# EasyEDA Pro project Propj-AlmuxCybernet.epro, schematic Schematic1
Board Name: RPB2026; Create Date: 2026-03-13; Page Name: P1; Project Name: Almux - Cybernet; Schematic Name: Schematic1; Update Date: 2026-03-17; Company: EasyEDA.com; Page Size: A4; Version: V1.0
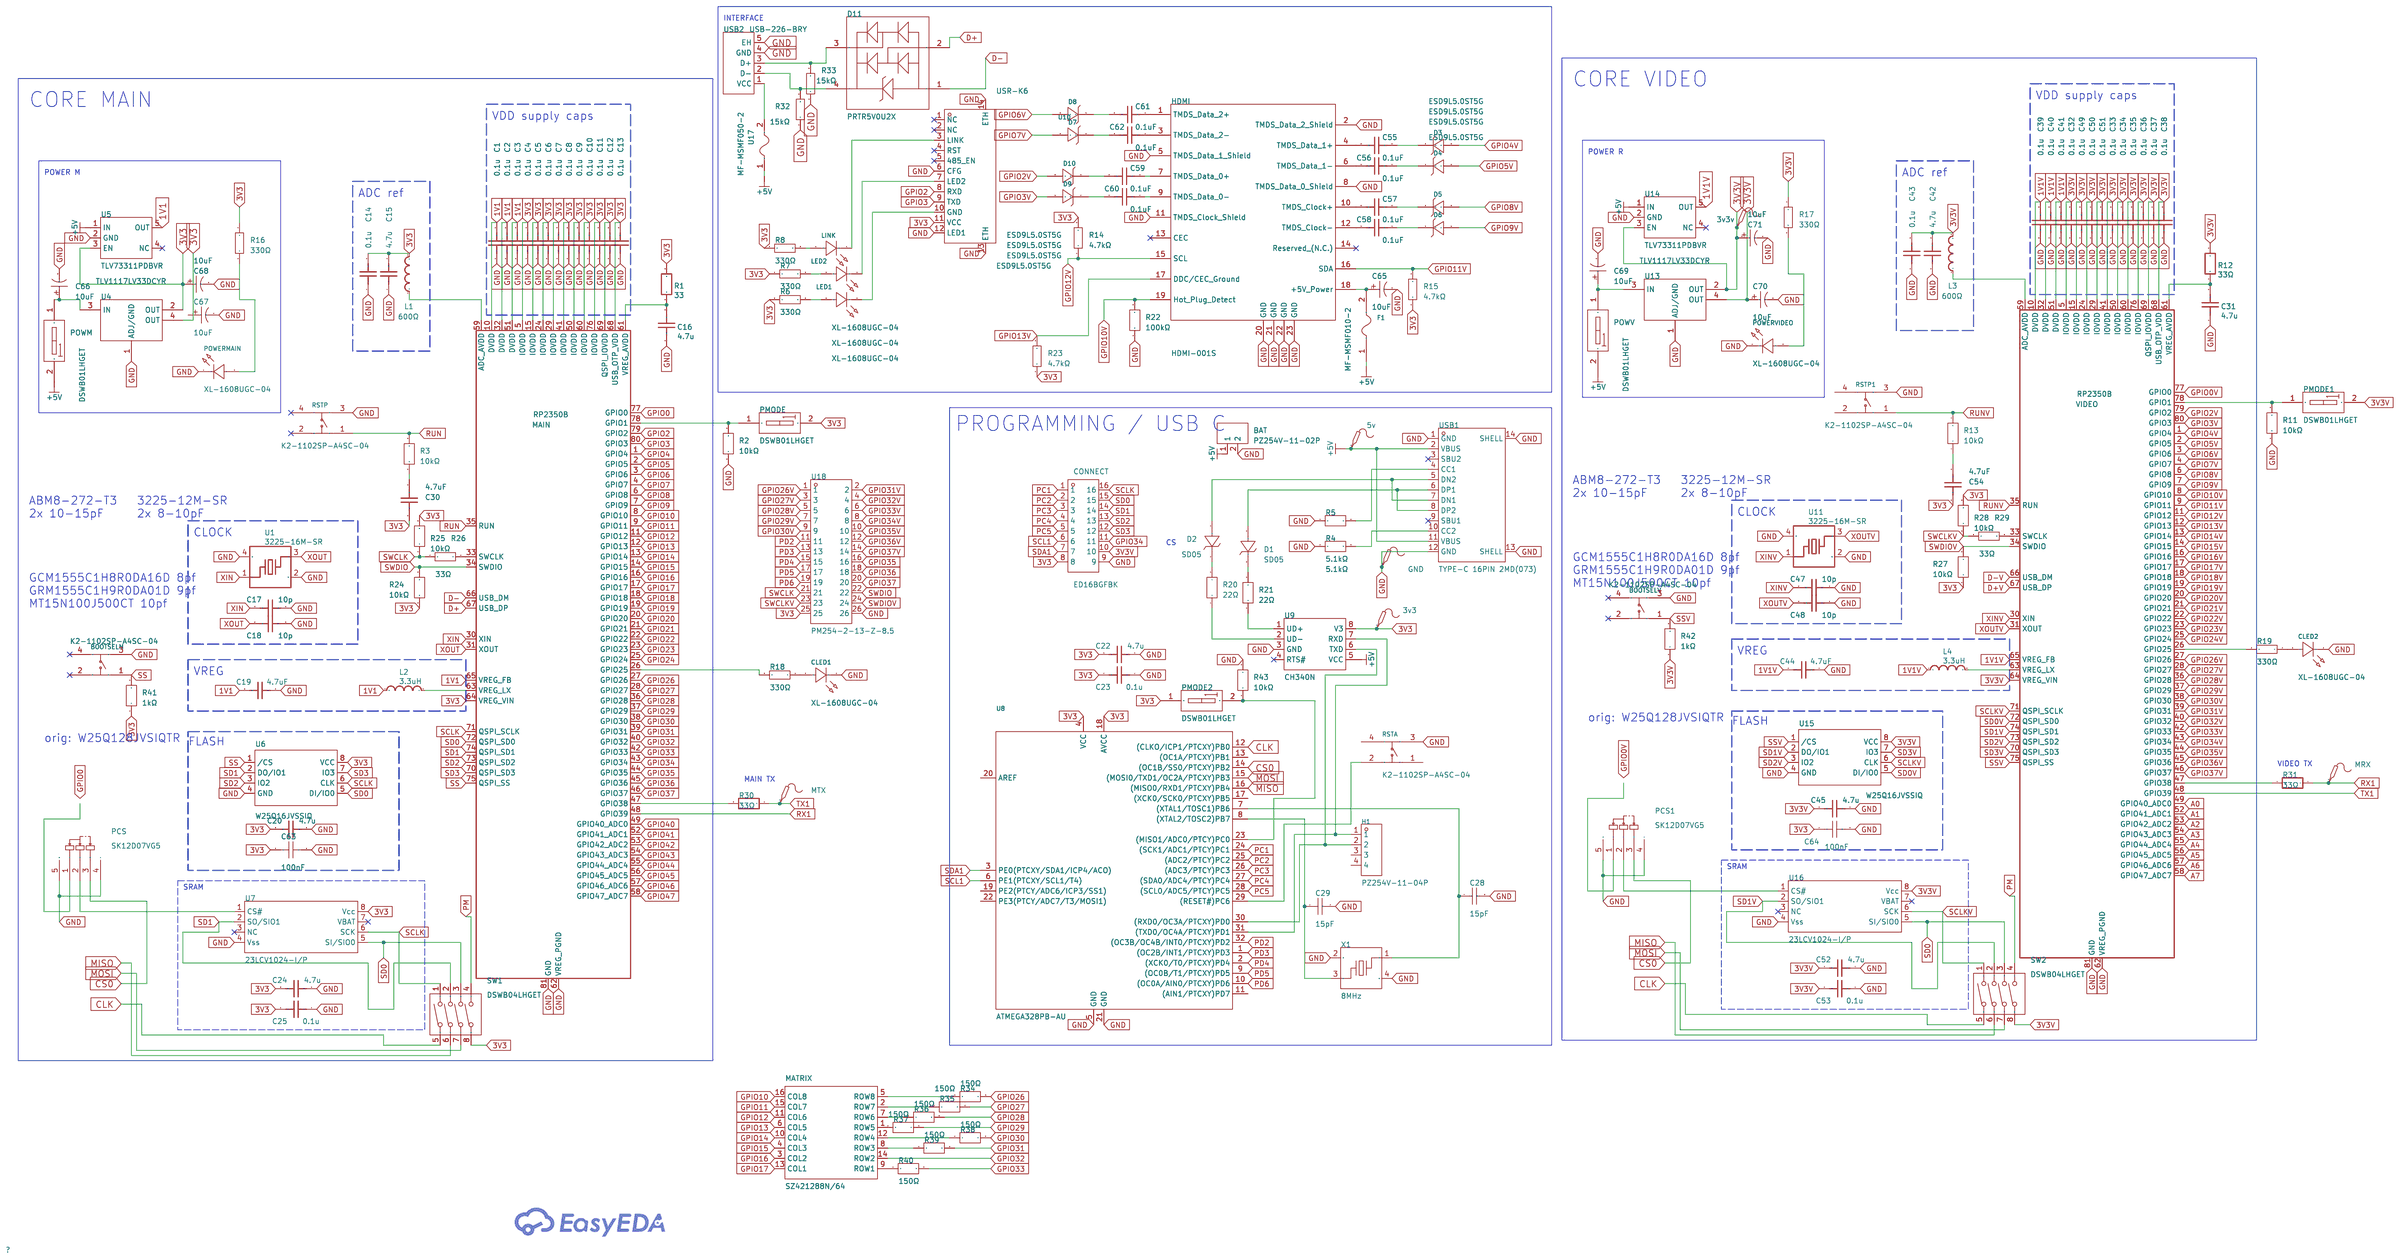
[diagram p1: schematic sheet]

## Parts
3v3  -  [Test-Point-0.5mm]
3v3v  -  [Test-Point-0.5mm]
5v  -  [Test-Point-0.5mm]
BAT  PZ254V-11-02P  [HDR-TH_2P-P2.54-V-M]
BOOTSELM  K2-1102SP-A4SC-04  [KEY-SMD_4P-L6.0-W6.0-P4.50-LS10.0]
BOOTSELV  K2-1102SP-A4SC-04  [KEY-SMD_4P-L6.0-W6.0-P4.50-LS10.0]
C1  0.1u  [C0402]
C2  0.1u  [C0402]
C3  0.1u  [C0402]
C4  0.1u  [C0402]
C5  0.1u  [C0402]
C6  0.1u  [C0402]
C7  0.1u  [C0402]
C8  0.1u  [C0402]
C9  0.1u  [C0402]
C10  0.1u  [C0402]
C11  0.1u  [C0402]
C12  0.1u  [C0402]
C13  0.1u  [C0402]
C14  0.1u  [C0402]
C15  4.7u  [C0603]
C16  4.7u  [C0603]
C17  10p  [C0402]
C18  10p  [C0402]
C19  4.7uF  [C0603]
C20  4.7u  [C0603]
C22  4.7u  [C0603]
C23  0.1u  [C0402]
C24  4.7u  [C0603]
C25  0.1u  [C0402]
C28  15pF  [C0603]
C29  15pF  [C0603]
C30  4.7uF  [C0603]
C31  4.7u  [C0603]
C32  0.1u  [C0402]
C33  0.1u  [C0402]
C34  0.1u  [C0402]
C35  0.1u  [C0402]
C36  0.1u  [C0402]
C37  0.1u  [C0402]
C38  0.1u  [C0402]
C39  0.1u  [C0402]
C40  0.1u  [C0402]
C41  0.1u  [C0402]
C42  4.7u  [C0603]
C43  0.1u  [C0402]
C44  4.7uF  [C0603]
C45  4.7u  [C0603]
C47  10p  [C0402]
C48  10p  [C0402]
C49  0.1u  [C0402]
C50  0.1u  [C0402]
C51  0.1u  [C0402]
C52  4.7u  [C0603]
C53  0.1u  [C0402]
C54  4.7uF  [C0603]
C55  0.1uF  [C0402]
C56  0.1uF  [C0402]
C57  0.1uF  [C0402]
C58  0.1uF  [C0402]
C59  0.1uF  [C0402]
C60  0.1uF  [C0402]
C61  0.1uF  [C0402]
C62  0.1uF  [C0402]
C63  100nF  [C0402]
C64  100nF  [C0402]
C65  10uF  [CAP-SMD_BD5.0-L5.3-W5.3-FD]
C66  10uF  [CAP-SMD_BD5.0-L5.3-W5.3-FD]
C67  10uF  [CAP-SMD_BD5.0-L5.3-W5.3-FD]
C68  10uF  [CAP-SMD_BD5.0-L5.3-W5.3-FD]
C69  10uF  [CAP-SMD_BD5.0-L5.3-W5.3-FD]
C70  10uF  [CAP-SMD_BD5.0-L5.3-W5.3-FD]
C71  10uF  [CAP-SMD_BD5.0-L5.3-W5.3-FD]
CLED1  XL-1608UGC-04  [LED0603-RD_GREEN]
CLED2  XL-1608UGC-04  [LED0603-RD_GREEN]
CONNECT  ED16BGFBK  [CONN-TH_ED16BGFBK]
D1  SD05  [SOD-323_L1.8-W1.3-LS2.5-FD]
D2  SD05  [SOD-323_L1.8-W1.3-LS2.5-FD]
D3  ESD9L5.0ST5G  [SOD-923_L0.8-W0.6-LS1.0-RD]
D4  ESD9L5.0ST5G  [SOD-923_L0.8-W0.6-LS1.0-RD]
D5  ESD9L5.0ST5G  [SOD-923_L0.8-W0.6-LS1.0-RD]
D6  ESD9L5.0ST5G  [SOD-923_L0.8-W0.6-LS1.0-RD]
D7  ESD9L5.0ST5G  [SOD-923_L0.8-W0.6-LS1.0-RD]
D8  ESD9L5.0ST5G  [SOD-923_L0.8-W0.6-LS1.0-RD]
D9  ESD9L5.0ST5G  [SOD-923_L0.8-W0.6-LS1.0-RD]
D10  ESD9L5.0ST5G  [SOD-923_L0.8-W0.6-LS1.0-RD]
D11  PRTR5V0U2X  [SOT-143_L2.9-W1.3-P1.92-LS2.3-BL]
F1  MF-MSMF010-2  [F1812]
GND  -  [Test-Point-0.5mm]
H1  PZ254V-11-04P  [HDR-TH_4P-P2.54-V-M]
HDMI  HDMI-001S  [HDMI-SMD_HDMI-001S]
L1  600Ω  [L0603]
L2  3.3uH  [L1008]
L3  600Ω  [L0603]
L4  3.3uH  [L1008]
LED1  XL-1608UGC-04  [LED0603-RD_GREEN]
LED2  XL-1608UGC-04  [LED0603-RD_GREEN]
LINK  XL-1608UGC-04  [LED0603-RD_GREEN]
MAIN  RP2350B  [QFN-80_L10.0-W10.0-P0.40-TL-EP3.4]
MATRIX  SZ421288N/64  [LED-SEG-TH_SZ421288N-64]
MRX  -  [Test-Point-0.5mm]
MTX  -  [Test-Point-0.5mm]
PCS  SK12D07VG5  [SW-TH_SK12D07VG5-1]
PCS1  SK12D07VG5  [SW-TH_SK12D07VG5-1]
PMODE  DSWB01LHGET  [SW-TH_DSWB01LHGET]
PMODE1  DSWB01LHGET  [SW-TH_DSWB01LHGET]
PMODE2  DSWB01LHGET  [SW-TH_DSWB01LHGET]
POWERMAIN  XL-1608UGC-04  [LED0603-RD_GREEN]
POWERVIDEO  XL-1608UGC-04  [LED0603-RD_GREEN]
POWM  DSWB01LHGET  [SW-TH_DSWB01LHGET]
POWV  DSWB01LHGET  [SW-TH_DSWB01LHGET]
R1  33  [R0402]
R2  10kΩ  [R0805]
R3  10kΩ  [R0805]
R4  5.1kΩ  [R1206]
R5  5.1kΩ  [R1206]
R6  330Ω  [R0603]
R7  330Ω  [R0603]
R8  330Ω  [R0603]
R11  10kΩ  [R0805]
R12  33Ω  [R0402]
R13  10kΩ  [R0805]
R14  4.7kΩ  [R0603]
R15  4.7kΩ  [R0603]
R16  330Ω  [R0603]
R17  330Ω  [R0603]
R18  330Ω  [R0603]
R19  330Ω  [R0603]
R20  22Ω  [R0603]
R21  22Ω  [R0603]
R22  100kΩ  [R1206]
R23  4.7kΩ  [R0603]
R24  10kΩ  [R0805]
R25  10kΩ  [R0805]
R26  33Ω  [R0603]
R27  10kΩ  [R0805]
R28  10kΩ  [R0805]
R29  33Ω  [R0603]
R30  33Ω  [R0402]
R31  33Ω  [R0402]
R32  15kΩ  [R0805]
R33  15kΩ  [R0805]
R34  150Ω  [R0805]
R35  150Ω  [R0805]
R36  150Ω  [R0805]
R37  150Ω  [R0805]
R38  150Ω  [R0805]
R39  150Ω  [R0805]
R40  150Ω  [R0805]
R41  1kΩ  [R0603]
R42  1kΩ  [R0603]
R43  10kΩ  [R0805]
RSTA  K2-1102SP-A4SC-04  [KEY-SMD_4P-L6.0-W6.0-P4.50-LS10.0]
RSTP  K2-1102SP-A4SC-04  [KEY-SMD_4P-L6.0-W6.0-P4.50-LS10.0]
RSTP1  K2-1102SP-A4SC-04  [KEY-SMD_4P-L6.0-W6.0-P4.50-LS10.0]
SW1  DSWB04LHGET  [SW-TH_DSWB04LHGET]
SW2  DSWB04LHGET  [SW-TH_DSWB04LHGET]
U1  3225-16M-SR  [CRYSTAL-SMD_4P-L3.2-W2.5-BL]
U4  TLV1117LV33DCYR  [SOT-223_L6.7-W3.5-P2.30-BR]
U5  TLV73311PDBVR  [SOT-23-5_L2.9-W1.6-P0.95-LS2.8-BR]
U6  W25Q16JVSSIQ  [SOIC-8_L5.3-W5.3-P1.27-LS8.0-BL]
U7  23LCV1024-I/P  [PDIP-8_L9.3-W6.4-P2.54-LS7.6-BL]
U8  ATMEGA328PB-AU  [TQFP-32_L7.0-W7.0-P0.80-LS9.0-BL]
U9  CH340N  [SOP-8_L4.9-W3.9-P1.27-LS6.0-BL]
U10  USR-K6  [COMM_USR-K6]
U11  3225-16M-SR  [CRYSTAL-SMD_4P-L3.2-W2.5-BL]
U13  TLV1117LV33DCYR  [SOT-223_L6.7-W3.5-P2.30-BR]
U14  TLV73311PDBVR  [SOT-23-5_L2.9-W1.6-P0.95-LS2.8-BR]
U15  W25Q16JVSSIQ  [SOIC-8_L5.3-W5.3-P1.27-LS8.0-BL]
U16  23LCV1024-I/P  [PDIP-8_L9.3-W6.4-P2.54-LS7.6-BL]
U17  MF-MSMF050-2  [F1812]
U18  PM254-2-13-Z-8.5  [HDR-TH_26P-P2.54-V-F-R2-C13-S2.54-1]
USB1  TYPE-C 16PIN 2MD(073)  [USB-C-SMD_TYPE-C-6PIN-2MD-073]
USB2  USB-226-BRY  [USB-A-TH_USB-226-BRY]
VIDEO  RP2350B  [QFN-80_L10.0-W10.0-P0.40-TL-EP3.4]
X1  8MHz  [CRYSTAL-SMD_4P-L3.2-W2.5-BL]

## Library data of the parts
3v3 3v3v 5v GND MRX MTX = Test-Point: Test Point 测试点
BAT = PZ254V-11-02P: Pin Structure:1x2P Pitch:2.54mm Row Spacing:- Circluar Pins/Square Pins:Pin Header Mounting Type:Through Hole Number of Rows:1 Number of Pins:2P Current Rating:3A Voltage Rating (Max):250V Length of Mating Pin:6mm Insulation Height:2.5mm Length of End Con; LCSC Part Name: 1x2P 间距:2.54mm 方针 直插; Supplier Part: C492401; Manufacturer: XFCN(兴飞); Supplier Footprint: 插件,P=2.54mm; JLCPCB Part Class: Extended Part; Datasheet: https://item.szlcsc.com/datasheet/PZ254V-11-02P/502957.html; Supplier: LCSC; Pin Structure: 1x2P; Pitch: 2.54mm; Circluar Pins/Square Pins: Pin Header; Mounting Type: Through Hole; Number of Rows: 1; Number of Pins: 2P; Current Rating: 3A; Voltage Rating (Max): 250V; Length of Mating Pin: 6mm; Insulation Height: 2.5mm; Length of End Connection Pin: 3mm; Contact Material: Brass; Operating Temperature: -40℃~+105℃; Color: Black
BOOTSELM BOOTSELV RSTA RSTP RSTP1 = K2-1102SP-A4SC-04: Circuit:SPST Actuator Style:Round Button Operating Force:2.5N Mounting Type:Surface Mount,Vertical Length:6mm Width:6mm Switch Height:4.3mm Contact Current:50mA Voltage Rating:12V With Lamp:- Life:100,000 Cycles Operating Temperature:-25℃~+85℃ Operating T; LCSC Part Name: 高品质 轻触开关 6*6*4.3 圆柄; Supplier Part: C83916; Manufacturer: 韩国韩荣; Supplier Footprint: SMD-4P,6x6mm; JLCPCB Part Class: Extended Part; Datasheet: https://item.szlcsc.com/datasheet/K2-1102SP-A4SC-04/85083.html; Supplier: LCSC; Circuit: SPST; Actuator Style: Round Button; Operating Force: 2.5N; Mounting Type: Surface Mount,Vertical; Length: 6mm; Width: 6mm; Switch Height: 4.3mm; Contact Current: 50mA; Voltage Rating: 12V; Life: 100,000 Cycles; Operating Temperature: -25℃~+85℃
C1-C14 C23 C25 C32-C41 C43 C49-C51 C53 C55-C62 = 0.1u: Supplier Part: CL05B104KP5NNNC; Supplier: Tme; Manufacturer Part: CL05B104KP5NNNC; Manufacturer: SAMSUNG; nameAlias: Value(F); Contributor: LCEDA_Lib; spicePre: C; spiceSymbolName: C_0402_US
C15 C16 C19 C20 C22 C24 C30 C31 C42 C44 C45 C52 C54 = 4.7u: Supplier Part: 0603X475K100CT; Supplier: Tme; Manufacturer Part: 0603X475K100CT; Manufacturer: WALSIN; nameAlias: Value(F); Contributor: LCEDA_Lib; spicePre: C; spiceSymbolName: C_0402_US
C17 C18 C47 C48 = 10p: Supplier Part: MT15N100J500CT; Supplier: Tme; Manufacturer Part: MT15N100J500CT; Manufacturer: WALSIN; nameAlias: Value(F); Contributor: LCEDA_Lib; spicePre: C; spiceSymbolName: C_0402_US
C28 C29 = CL10C150JB8NNNC: Capacitance:15pF Tolerance:±5% Tolerance:±5% Voltage Rating:50V Temperature Coefficient:C0G; LCSC Part Name: 15pF ±5% 50V; Supplier Part: C1644; Manufacturer: SAMSUNG(三星); Supplier Footprint: 0603; JLCPCB Part Class: Basic Part; Datasheet: https://item.szlcsc.com/datasheet/CL10C150JB8NNNC/1996.html; Supplier: LCSC; Tolerance: ±5%; Voltage Rating: 50V; Temperature Coefficient: C0G
C63 C64 = CL05B104KB54PNC: Capacitance:100nF Tolerance:±10% Tolerance:±10% Voltage Rating:50V Temperature Coefficient:X7R; LCSC Part Name: 100nF ±10% 50V; Supplier Part: C307331; Manufacturer: SAMSUNG(三星); Supplier Footprint: 0402; JLCPCB Part Class: Basic Part; Datasheet: https://item.szlcsc.com/datasheet/CL05B104KB54PNC/291005.html; Supplier: LCSC; Tolerance: ±10%; Voltage Rating: 50V; Temperature Coefficient: X7R
C65-C71 = RVT1H100M0505_C72487: Capacitance:10uF Tolerance:±20% Tolerance:±20% Voltage Rating:50V Ripple Current:17mA@120Hz Equivalent Series Resistance(ESR):- Diameter:5mm Height - Seated (Max):5.4mm Lifetime:2000hrs@105℃ Operating Temperature:-40℃~+105℃ Operating Temperature:-40℃~+105; LCSC Part Name: 10uF ±20% 50V; Supplier Part: C72487; Manufacturer: ROQANG(容强); Manufacturer Part: RVT1H100M0505; Supplier Footprint: SMD,D5xL5.4mm; JLCPCB Part Class: Extended Part; Datasheet: https://item.szlcsc.com/datasheet/RVT1H100M0505/73598.html; Supplier: LCSC; Tolerance: ±20%; Voltage Rating: 50V; Ripple Current: 17mA@120Hz; Diameter: 5mm; Height - Seated (Max): 5.4mm; Lifetime: 2000hrs@105℃; Operating Temperature: -40℃~+105℃
CLED1 CLED2 LED1 LED2 LINK POWERMAIN POWERVIDEO = XL-1608UGC-04: Lamp Holder Type:- Illumination Color:Emerald Green Voltage - Forward(Vf):3.3V Voltage - Forward(Vf):3.3V Power(Watts):70mW Forward Current:20mA Wavelength - Dominant:515nm~535nm Wavelength - Dominant:515nm~535nm Peak Wavelength:525nm Diode Configuration:; LCSC Part Name: 0603翠绿贴片式发光二极管; Supplier Part: C965804; Manufacturer: XINGLIGHT(成兴光); Supplier Footprint: 0603; JLCPCB Part Class: Extended Part; Datasheet: https://item.szlcsc.com/datasheet/XL-1608UGC-04/1051413.html; Supplier: LCSC; Illumination Color: Emerald Green; Voltage - Forward(Vf): 3.3V; Power(Watts): 70mW; Forward Current: 20mA; Wavelength - Dominant: 515nm~535nm; Peak Wavelength: 525nm; Diode Configuration: Discrete Diode; Lens Color: Water Clear; Luminous Intensity: 810mcd; Viewing Angle: 120°; Mounting Style: Top-mount; Operating Temperature: -40℃~+85℃
CONNECT = ED16BGFBK: Connector Type:EDGE SLOT Pitch:2.54mm Number of Pins:16P Mounting Type:Through Hole Height Above Board:15.6mm Contact Material:Copper Alloy Contact Plating:Gold Operating Temperature:-55℃~+125℃ Operating Temperature:-55℃~+125℃; LCSC Part Name: 2.54mm P数:16P; Supplier Part: C5173292; Manufacturer: WingTAT(格林柏); Supplier Footprint: 插件,P=2.54mm; JLCPCB Part Class: Extended Part; Datasheet: https://item.szlcsc.com/datasheet/ED16BGFBK/5822875.html; Supplier: LCSC; Connector Type: EDGE SLOT; Pitch: 2.54mm; Number of Pins: 16P; Mounting Type: Through Hole; Height Above Board: 15.6mm; Contact Material: Copper Alloy; Contact Plating: Gold; Operating Temperature: -55℃~+125℃
D1 D2 = SD05_C502527: Polarity:Unidirectional Reverse Stand-Off Voltage (Vrwm):5V Clamping Voltage:18V Peak Pulse Current (Ipp):17A Peak Pulse Power Dissipation (Ppp):350W Voltage - Breakdown:6V Reverse Leakage Current (Ir):1uA Number of Channels:1 Operating Temperature:-55℃~+; LCSC Part Name: 单向TVS 5V截止 峰值脉冲电流：17A; Supplier Part: C502527; Manufacturer: MDD(辰达半导体); Supplier Footprint: SOD-323; JLCPCB Part Class: Extended Part; Datasheet: https://item.szlcsc.com/datasheet/SD05/515033.html; Supplier: LCSC; Polarity: Unidirectional; Reverse Stand-Off Voltage (Vrwm): 5V; Clamping Voltage: 18V; Peak Pulse Current (Ipp): 17A; Peak Pulse Power Dissipation (Ppp): 350W; Voltage - Breakdown: 6V; Reverse Leakage Current (Ir): 1uA; Number of Channels: 1; Operating Temperature: -55℃~+125℃; level of protection: IEC 61000-4-2；IEC 61000-4-4; Type: TVS; Junction Capacitance: 10pF
D3-D10 = ESD9L5.0ST5G: Polarity:Unidirectional Reverse Stand-Off Voltage (Vrwm):5V Clamping Voltage:9.8V Peak Pulse Current (Ipp):1A Peak Pulse Power Dissipation (Ppp):- Voltage - Breakdown:5.4V Reverse Leakage Current (Ir):1uA Number of Channels:1 Operating Temperature:-55℃~+1; LCSC Part Name: 单向ESD 5V截止 峰值脉冲电流：1A; Supplier Part: C82326; Manufacturer: onsemi(安森美); Supplier Footprint: SOD-923; JLCPCB Part Class: Extended Part; Datasheet: https://item.szlcsc.com/datasheet/ESD9L5.0ST5G/83483.html; Supplier: LCSC; Polarity: Unidirectional; Reverse Stand-Off Voltage (Vrwm): 5V; Clamping Voltage: 9.8V; Peak Pulse Current (Ipp): 1A; Voltage - Breakdown: 5.4V; Reverse Leakage Current (Ir): 1uA; Number of Channels: 1; Operating Temperature: -55℃~+150℃@(Tj); level of protection: IEC 61000-4-2; Type: ESD; Junction Capacitance: 0.9pF
D11 = PRTR5V0U2X_C21713980: Polarity:Unidirectional Reverse Stand-Off Voltage (Vrwm):5V Clamping Voltage:14V；16V Peak Pulse Current (Ipp):4A Peak Pulse Power Dissipation (Ppp):60W Voltage - Breakdown:6V Reverse Leakage Current (Ir):500nA Number of Channels:2 Operating Temperature:-5; LCSC Part Name: 丝印WR1 单向ESD 5V截止 峰值脉冲电流：4A; Supplier Part: C21713980; Manufacturer: GOODWORK(固得沃克); Supplier Footprint: SOT-143; JLCPCB Part Class: Extended Part; Datasheet: https://item.szlcsc.com/datasheet/PRTR5V0U2X/23140173.html; Supplier: LCSC; Polarity: Unidirectional; Reverse Stand-Off Voltage (Vrwm): 5V; Clamping Voltage: 14V；16V; Peak Pulse Current (Ipp): 4A; Peak Pulse Power Dissipation (Ppp): 60W; Voltage - Breakdown: 6V; Reverse Leakage Current (Ir): 500nA; Number of Channels: 2; Operating Temperature: -55℃~+125℃; level of protection: IEC 61000-4-2; Type: ESD; Junction Capacitance: 0.6pF；0.3pF
F1 = MF-MSMF010-2: Voltage - Max:60V Current - Max:40A Hold Current:100mA Trip Current:300mA Resistance - Initial (Ri) (Min):700mΩ Resistance - Post Trip (R1) (Max):15Ω Time to Trip(Max):- Operating Temperature:-40℃~+85℃ Operating Temperature:-40℃~+85℃ Length:5.4mm Width:3.; LCSC Part Name: 60V 100mA 1812自恢复; Supplier Part: C12430; Manufacturer: BOURNS; Supplier Footprint: 1812; JLCPCB Part Class: Extended Part; Datasheet: https://item.szlcsc.com/datasheet/MF-MSMF010-2/13063.html; Supplier: LCSC; Voltage - Max: 60V; Current - Max: 40A; Hold Current: 100mA; Trip Current: 300mA; Resistance - Initial (Ri) (Min): 700mΩ; Resistance - Post Trip (R1) (Max): 15Ω; Operating Temperature: -40℃~+85℃; Length: 5.4mm; Width: 3.2mm
H1 = PZ254V-11-04P: Pin Structure:1x4P Pitch:2.54mm Row Spacing:- Circluar Pins/Square Pins:Pin Header Mounting Type:Through Hole Number of Rows:1 Number of Pins:4P Current Rating:3A Voltage Rating (Max):250V Length of Mating Pin:6mm Insulation Height:2.5mm Length of End Con; LCSC Part Name: 1x4P 间距:2.54mm 方针 直插; Supplier Part: C2691448; Manufacturer: XFCN(兴飞); Supplier Footprint: 插件,P=2.54mm; JLCPCB Part Class: Extended Part; Datasheet: https://item.szlcsc.com/datasheet/PZ254V-11-04P/2801085.html; Supplier: LCSC; Pin Structure: 1x4P; Pitch: 2.54mm; Circluar Pins/Square Pins: Pin Header; Mounting Type: Through Hole; Number of Rows: 1; Number of Pins: 4P; Current Rating: 3A; Voltage Rating (Max): 250V; Length of Mating Pin: 6mm; Insulation Height: 2.5mm; Length of End Connection Pin: 3mm; Operating Temperature: -40℃~+105℃; Color: Black
HDMI = HDMI-001S: Connector Type:HDMI-A Gender:Female Number of Pins:19P Mounting Type:Surface Mount, Right Angle Current Rating:- Voltage Rating:- Operating Temperature:- Operating Temperature:-; Supplier Part: C720616; Manufacturer: XUNPU(讯普); Supplier Footprint: SMD; JLCPCB Part Class: Extended Part; Datasheet: https://item.szlcsc.com/datasheet/HDMI-001S/763623.html; Supplier: LCSC; Connector Type: HDMI-A; Gender: Female; Number of Pins: 19P; Mounting Type: Surface Mount, Right Angle
L1 L3 = 600Ω: Supplier: Tme; Manufacturer: muRata; Manufacturer Part: BLM18HE601SN1D; Supplier Part: BLM18HE601SN1D; nameAlias: Value; spicePre: L; spiceSymbolName: BLM18HE601SN1D
L2 L4 = 3.3uH: Supplier: Tme; Supplier Part: LQM2HPN3R3MG0L; Manufacturer: MURATA; Manufacturer Part: LQM2HPN3R3MG0L; nameAlias: Value; Contributor: Nephrite; spicePre: L; spiceSymbolName: AOTA-B201610S3R3-101-T
MAIN VIDEO = RP2350B: Supplier: LCSC; Supplier Part: C9900136713; Manufacturer: null; Contributor: lcsc; spicePre: U
MATRIX = SZ421288N/64: Dot Matrix Number:8x8 Emitting Color:Red Polarity:共阴极; LCSC Part Name: 8x8位共阴极红色LED点阵; Supplier Part: C2980922; Manufacturer: ARKLED(方舟); Supplier Footprint: 插件; JLCPCB Part Class: Extended Part; Datasheet: https://atta.szlcsc.com/upload/public/pdf/source/20220310/56594458C5EED5BEAFFDE966345907D8.pdf; Supplier: LCSC; Dot Matrix Number: 8x8; Emitting Color: Red; Polarity: 共阴极
PCS PCS1 = SK12D07VG5: Circuit:SPDT Actuator Style:- Termination Style:PC Pin Length:8.7mm Width:4.4mm Switch Height:4.7mm Mounting Type:- Actuator Color:- Current Rating:500mA Voltage Rating:50V Life:5,000 cycles Operating Temperature:-10℃~+50℃ Operating Temperature:-10℃~+50℃; Supplier Part: C431548; Manufacturer: SHOU HAN(首韩); Supplier Footprint: 插件,8.7x4.4mm; JLCPCB Part Class: Extended Part; Datasheet: https://item.szlcsc.com/datasheet/SK12D07VG5/427905.html; Supplier: LCSC; Circuit: SPDT; Termination Style: PC Pin; Length: 8.7mm; Width: 4.4mm; Switch Height: 4.7mm; Current Rating: 500mA; Voltage Rating: 50V; Life: 5,000 cycles; Operating Temperature: -10℃~+50℃
PMODE PMODE1 PMODE2 POWM POWV = DSWB01LHGET: Type:Slide, Rocked Circuit:SPST Number of Positions:1 Lead Pitch:- Operating Life:- Color:Red; LCSC Part Name: 红色宽体1位顶拨插件; Supplier Part: C126888; Manufacturer: YE; Supplier Footprint: 插件,9.9x4mm; JLCPCB Part Class: Extended Part; Datasheet: https://item.szlcsc.com/datasheet/DSWB01LHGET/138168.html; Supplier: LCSC; Type: Slide, Rocked; Circuit: SPST; Number of Positions: 1; Color: Red
R1 R12 R30 R31 = 33: Supplier Part: HP02-33R1%; Supplier: Tme; Manufacturer Part: HP02WAF330JTCE; Manufacturer: ROYALOHM; nameAlias: Value(Ω); Contributor: LCEDA_Lib; spicePre: R; spiceSymbolName: R_0402_EU
R2 R3 R11 R13 R24 R25 R27 R28 R43 = FRC0805J103TS: Type:Thick Film Resistor Resistance:10kΩ Tolerance:±5% Tolerance:±5% Power(Watts):125mW Voltage-Supply(Max):150V Temperature Coefficient:±100ppm/℃ Temperature Coefficient:±100ppm/℃ Operating Temperature:-55℃~+155℃ Operating Temperature:-55℃~+155℃; LCSC Part Name: 10kΩ ±5% 125mW 厚膜电阻; Supplier Part: C2930231; Manufacturer: FOJAN(富捷); Supplier Footprint: 0805; JLCPCB Part Class: Extended Part; Supplier: LCSC; Type: Thick Film Resistor; Tolerance: ±5%; Power(Watts): 125mW; Voltage-Supply(Max): 150V; Temperature Coefficient: ±100ppm/℃; Operating Temperature: -55℃~+155℃
R4 R5 = FRC1206J512 TS: Type:Thick Film Resistor Resistance:5.1kΩ Tolerance:±5% Tolerance:±5% Power(Watts):250mW Voltage-Supply(Max):200V Temperature Coefficient:±100ppm/℃ Temperature Coefficient:±100ppm/℃ Operating Temperature:-55℃~+155℃ Operating Temperature:-55℃~+155℃; LCSC Part Name: 5.1kΩ ±5% 250mW 厚膜电阻; Supplier Part: C2907509; Manufacturer: FOJAN(富捷); Supplier Footprint: 1206; JLCPCB Part Class: Extended Part; Supplier: LCSC; Type: Thick Film Resistor; Tolerance: ±5%; Power(Watts): 250mW; Voltage-Supply(Max): 200V; Temperature Coefficient: ±100ppm/℃; Operating Temperature: -55℃~+155℃
R6-R8 R16-R19 = 0603WAF3300T5E: Type:Thick Film Resistors Resistance: Tolerance:±1% Tolerance:±1% Power(Watts): Overload Voltage (Max): Temperature Coefficient:±100ppm/℃ Temperature Coefficient:±100ppm/℃ Operating Temperature Range:-55℃~+155℃ Operating Temperature Range:-55℃~+155℃; LCSC Part Name: 330Ω ±1% 100mW 厚膜电阻; Supplier Part: C23138; Manufacturer: UNI-ROYAL(厚声); Supplier Footprint: 0603; JLCPCB Part Class: Basic Part; Datasheet: https://atta.szlcsc.com/upload/public/pdf/source/20200306/C422600_1E6D84923E4A46A82E41ADD87F860B5C.pdf; Supplier: LCSC; Type: Thick Film Resistors; Tolerance: ±1%; Temperature Coefficient: ±100ppm/℃; Operating Temperature Range: -55℃~+155℃
R14 R15 R23 = 0603WAF4701T5E: Type:Thick Film Resistor Resistance:4.7kΩ Tolerance:±1% Tolerance:±1% Power(Watts):100mW Voltage-Supply(Max):75V Temperature Coefficient:±100ppm/℃ Temperature Coefficient:±100ppm/℃ Operating Temperature:-55℃~+155℃ Operating Temperature:-55℃~+155℃; LCSC Part Name: 4.7kΩ ±1% 100mW 厚膜电阻; Supplier Part: C23162; Manufacturer: UNI-ROYAL(厚声); Supplier Footprint: 0603; JLCPCB Part Class: Basic Part; Datasheet: https://item.szlcsc.com/datasheet/0603WAF4701T5E/23889.html; Supplier: LCSC; Type: Thick Film Resistor; Tolerance: ±1%; Power(Watts): 100mW; Voltage-Supply(Max): 75V; Temperature Coefficient: ±100ppm/℃; Operating Temperature: -55℃~+155℃
R20 R21 = FRC0603J220 TS: Type:Thick Film Resistor Resistance:22Ω Tolerance:±5% Tolerance:±5% Power(Watts):100mW Voltage-Supply(Max):75V Temperature Coefficient:±100ppm/℃ Temperature Coefficient:±100ppm/℃ Operating Temperature:-55℃~+155℃ Operating Temperature:-55℃~+155℃; LCSC Part Name: 22Ω ±5% 100mW 厚膜电阻; Supplier Part: C2907129; Manufacturer: FOJAN(富捷); Supplier Footprint: 0603; JLCPCB Part Class: Extended Part; Supplier: LCSC; Type: Thick Film Resistor; Tolerance: ±5%; Power(Watts): 100mW; Voltage-Supply(Max): 75V; Temperature Coefficient: ±100ppm/℃; Operating Temperature: -55℃~+155℃
R22 = FRC1206J104 TS: Type:Thick Film Resistor Resistance:100kΩ Tolerance:±5% Tolerance:±5% Power(Watts):250mW Voltage-Supply(Max):200V Temperature Coefficient:±100ppm/℃ Temperature Coefficient:±100ppm/℃ Operating Temperature:-55℃~+155℃ Operating Temperature:-55℃~+155℃; LCSC Part Name: 100kΩ ±5% 250mW 厚膜电阻; Supplier Part: C2907421; Manufacturer: FOJAN(富捷); Supplier Footprint: 1206; JLCPCB Part Class: Extended Part; Supplier: LCSC; Type: Thick Film Resistor; Tolerance: ±5%; Power(Watts): 250mW; Voltage-Supply(Max): 200V; Temperature Coefficient: ±100ppm/℃; Operating Temperature: -55℃~+155℃
R26 R29 = RC0603FR-0733RL: Type:Thick Film Resistor Resistance:33Ω Tolerance:±1% Tolerance:±1% Power(Watts):100mW Voltage-Supply(Max):75V Temperature Coefficient:±100ppm/℃ Temperature Coefficient:±100ppm/℃ Operating Temperature:-55℃~+155℃ Operating Temperature:-55℃~+155℃; LCSC Part Name: 厚膜电阻 33Ω ±1% 100mW; Supplier Part: C108661; Manufacturer: YAGEO(国巨); Supplier Footprint: 0603; JLCPCB Part Class: Extended Part; Datasheet: https://item.szlcsc.com/datasheet/RC0603FR-0733RL/109880.html; Supplier: LCSC; Type: Thick Film Resistor; Tolerance: ±1%; Power(Watts): 100mW; Voltage-Supply(Max): 75V; Temperature Coefficient: ±100ppm/℃; Operating Temperature: -55℃~+155℃
R32 R33 = RC0805FR-0715KL: Type:Thick Film Resistor Resistance:15kΩ Tolerance:±1% Tolerance:±1% Power(Watts):125mW Voltage-Supply(Max):150V Temperature Coefficient:±100ppm/℃ Temperature Coefficient:±100ppm/℃ Operating Temperature:-55℃~+155℃ Operating Temperature:-55℃~+155℃; LCSC Part Name: 厚膜电阻 15kΩ ±1% 125mW; Supplier Part: C114559; Manufacturer: YAGEO(国巨); Supplier Footprint: 0805; JLCPCB Part Class: Extended Part; Datasheet: https://item.szlcsc.com/datasheet/RC0805FR-0715KL/115803.html; Supplier: LCSC; Type: Thick Film Resistor; Tolerance: ±1%; Power(Watts): 125mW; Voltage-Supply(Max): 150V; Temperature Coefficient: ±100ppm/℃; Operating Temperature: -55℃~+155℃
R34-R40 = FRC0805J151 TS: Type:Thick Film Resistor Resistance:150Ω Tolerance:±5% Tolerance:±5% Power(Watts):125mW Voltage-Supply(Max):150V Temperature Coefficient:±100ppm/℃ Temperature Coefficient:±100ppm/℃ Operating Temperature:-55℃~+155℃ Operating Temperature:-55℃~+155℃; LCSC Part Name: 150Ω ±5% 125mW 厚膜电阻; Supplier Part: C2907300; Manufacturer: FOJAN(富捷); Supplier Footprint: 0805; JLCPCB Part Class: Extended Part; Supplier: LCSC; Type: Thick Film Resistor; Tolerance: ±5%; Power(Watts): 125mW; Voltage-Supply(Max): 150V; Temperature Coefficient: ±100ppm/℃; Operating Temperature: -55℃~+155℃
R41 R42 = FRC0603J102 TS: Type:Thick Film Resistor Resistance:1kΩ Tolerance:±5% Tolerance:±5% Power(Watts):100mW Voltage-Supply(Max):75V Temperature Coefficient:±100ppm/℃ Temperature Coefficient:±100ppm/℃ Operating Temperature:-55℃~+155℃ Operating Temperature:-55℃~+155℃; LCSC Part Name: 1kΩ ±5% 100mW 厚膜电阻; Supplier Part: C2907113; Manufacturer: FOJAN(富捷); Supplier Footprint: 0603; JLCPCB Part Class: Extended Part; Supplier: LCSC; Type: Thick Film Resistor; Tolerance: ±5%; Power(Watts): 100mW; Voltage-Supply(Max): 75V; Temperature Coefficient: ±100ppm/℃; Operating Temperature: -55℃~+155℃
SW1 SW2 = DSWB04LHGET: Type:Slide, Rocked Circuit:SPST Number of Positions:4 Lead Pitch:2.54mm Operating Life:- Color:Red; LCSC Part Name: 间距2.54mm 平拨,凸起式 4位拨码开关; Supplier Part: C99418; Manufacturer: YE; Supplier Footprint: 插件; JLCPCB Part Class: Extended Part; Datasheet: https://item.szlcsc.com/datasheet/DSWB04LHGET/100632.html; Supplier: LCSC; Type: Slide, Rocked; Circuit: SPST; Number of Positions: 4; Lead Pitch: 2.54mm; Color: Red
U1 U11 = 3225-16M-SR: Supplier: Tme; Supplier Part: 3225-12M-SR; Manufacturer: SR Passives; Contributor: lcsc; spicePre: U
U4 U13 = TLV1117LV33DCYR: Output Type:Fixed Maximum Input Voltage:5.5V Output Voltage:3.3V Output Voltage:3.3V Output Current:1A Power Supply Rejection Ratio (PSRR):75dB@(120Hz) Dropout Voltage:1.3V@(800mA) standby current:100uA Feature:ESD Protection；Low ESR；Thermal Protection(TS; LCSC Part Name: 1A 低压降稳压器; Supplier Part: C15578; Manufacturer: TI(德州仪器); Supplier Footprint: SOT-223; JLCPCB Part Class: Extended Part; Datasheet: https://www.ti.com/cn/lit/gpn/tlv1117lv; Supplier: LCSC; Output Type: Fixed; Maximum Input Voltage: 5.5V; Output Voltage: 3.3V; Output Current: 1A; Power Supply Rejection Ratio (PSRR): 75dB@(120Hz); Dropout Voltage: 1.3V@(800mA); standby current: 100uA; Feature: ESD Protection；Low ESR；Thermal Protection(TSD)；Overcurrent Protection(OCP)；Under-voltage Lockout; Operating Temperature: -40℃~+125℃; Output Polarity: Positive electrode; Number of Outputs: 1
U5 U14 = TLV73311PDBVR: Output Type:Fixed Voltage - Supply:5.5V Output Voltage:1.1V Output Voltage:1.1V Output Current:300mA Power Supply Rejection Ratio (PSRR):50dB@(1kHz) Voltage Dropout:125mV@(300mA) standby current:34uA Noise:120uVrms Features:Over Current Protection；Enable；; LCSC Part Name: 具有使能功能的 300mA、低 IQ、低压降无电容稳压器; Supplier Part: C2865431; Manufacturer: TI(德州仪器); Supplier Footprint: SOT-23-5; JLCPCB Part Class: Extended Part; Datasheet: https://www.ti.com/cn/lit/gpn/tlv733p; Supplier: LCSC; Output Type: Fixed; Voltage - Supply: 5.5V; Output Voltage: 1.1V; Output Current: 300mA; Power Supply Rejection Ratio (PSRR): 50dB@(1kHz); Voltage Dropout: 125mV@(300mA); standby current: 34uA; Noise: 120uVrms; Features: Over Current Protection；Enable；Over Temperature Protection; Operating Temperature: -40℃~+125℃@(Tj); Output Configuration: Positive; Number of Outputs: 1
U6 U15 = W25Q16JVSSIQ: Interface:SPI Memory Size:16Mbit Clock Frequency:133MHz Voltage - Supply:2.7V~3.6V Voltage - Supply:2.7V~3.6V Standby Supply Current:10uA Program / Erase Cycles:100,000 Cycles Page Programming Time (Tpp):3ms Data Retention - TDR (Year):20 Years Operating; LCSC Part Name: 支持双/四路SPI接口的3V、16Mbit 串行闪存; Supplier Part: C131025; Manufacturer: Winbond(华邦); Supplier Footprint: SOIC-8-208mil; JLCPCB Part Class: Extended Part; Datasheet: https://item.szlcsc.com/datasheet/W25Q16JVSSIQ/142317.html; Supplier: LCSC; Interface: SPI; Memory Size: 16Mbit; Clock Frequency: 133MHz; Voltage - Supply: 2.7V~3.6V; Standby Supply Current: 10uA; Program / Erase Cycles: 100,000 Cycles; Page Programming Time (Tpp): 3ms; Data Retention - TDR (Year): 20 Years; Operating Temperature: -40℃~+85℃
U7 U16 = 23LCV1024-I/P_C613595: Interface:SPI Memory Size:1Mbit Voltage - Supply:2.5V~5.5V Voltage - Supply:2.5V~5.5V Write Cycle Time(Tw):- Operating Temperature:-40℃~+85℃ Operating Temperature:-40℃~+85℃; Supplier Part: C613595; Manufacturer: MICROCHIP(美国微芯); Supplier Footprint: PDIP-8; JLCPCB Part Class: Extended Part; Datasheet: https://item.szlcsc.com/datasheet/23LCV1024-I/P/643603.html; Supplier: LCSC; Interface: SPI; Memory Size: 1Mbit; Voltage - Supply: 2.5V~5.5V; Operating Temperature: -40℃~+85℃
U8 = ATMEGA328PB-AU: CPU Core:AVR CPU Maximum Speed:20MHz Core Size:8 Bit Program Storage Size:32KB Program Memory Type:FLASH RAM Size:2KB EEPROM:1KB Number of I/O:27 ADC (Bit):10bit Oscillator Type:Built-in Voltage - Supply:1.8V~5.5V Voltage - Supply:1.8V~5.5V Operating Temp; Supplier Part: C132230; Manufacturer: MICROCHIP(美国微芯); Supplier Footprint: TQFP-32(7x7); JLCPCB Part Class: Extended Part; Datasheet: https://item.szlcsc.com/datasheet/ATMEGA328PB-AU/143529.html; Supplier: LCSC; CPU Core: AVR; CPU Maximum Speed: 20MHz; Core Size: 8 Bit; Program Storage Size: 32KB; Program Memory Type: FLASH; RAM Size: 2KB; EEPROM: 1KB; Number of I/O: 27; ADC (Bit): 10bit; Oscillator Type: Built-in; Voltage - Supply: 1.8V~5.5V; Operating Temperature: -40℃~+85℃
U9 = CH340N: Applications Function:USB to serial USB Protocol:USB 2.0 Number of Channels:1 Voltage - Supply:3.3V；5V Voltage - Supply:3.3V；5V Data Rate:2Mbps Operating Temperature:-20℃~+70℃ Operating Temperature:-20℃~+70℃; LCSC Part Name: USB2.0芯片CH340; Supplier Part: C2977777; Manufacturer: WCH(南京沁恒); Supplier Footprint: SOP-8; JLCPCB Part Class: Extended Part; Datasheet: https://item.szlcsc.com/datasheet/CH340N/3390257.html; Supplier: LCSC; Applications Function: USB to serial; USB Protocol: USB 2.0; Number of Channels: 1; Voltage - Supply: 3.3V；5V; Data Rate: 2Mbps; Operating Temperature: -20℃~+70℃
U10 = USR-K6: LCSC Part Name: 串口服务器 UART转以太网双向透传 低成本; Supplier Part: C488063; Manufacturer: USR(有人物联网); JLCPCB Part Class: Extended Part; Datasheet: https://atta.szlcsc.com/upload/public/pdf/source/20200225/C488063_5605EE6D817113C23433343EB461AA97.pdf; Supplier: LCSC
U17 = MF-MSMF050-2: Voltage - Max:15V Current - Max:100A Hold Current:500mA Trip Current:1A Resistance - Initial (Ri) (Min):150mΩ Resistance - Post Trip (R1) (Max):1Ω Time to Trip(Max):- Operating Temperature:-40℃~+85℃ Operating Temperature:-40℃~+85℃ Length:5.4mm Width:3.2mm; LCSC Part Name: 15V 500mA 1812自恢复; Supplier Part: C17313; Manufacturer: BOURNS; Supplier Footprint: 1812; JLCPCB Part Class: Extended Part; Datasheet: https://item.szlcsc.com/datasheet/MF-MSMF050-2/17998.html; Supplier: LCSC; Voltage - Max: 15V; Current - Max: 100A; Hold Current: 500mA; Trip Current: 1A; Resistance - Initial (Ri) (Min): 150mΩ; Resistance - Post Trip (R1) (Max): 1Ω; Operating Temperature: -40℃~+85℃; Length: 5.4mm; Width: 3.2mm
U18 = PM254-2-13-Z-8.5: Holes Structure:2x13P Pitch:2.54mm Row Spacing:2.54mm Circular Hole / Square Hole:Square Hole Mounting Type:Through Hole Number of Rows:2 Number of Positions:26P Current Rating:3A Voltage Rating (Max):- Holes Direction:Top Insulation Height:8.5mm Contact; LCSC Part Name: 2x13P 间距:2.54mm 直插; Supplier Part: C2897414; Manufacturer: HCTL(华灿天禄); Supplier Footprint: 插件,P=2.54mm; JLCPCB Part Class: Extended Part; Datasheet: https://item.szlcsc.com/datasheet/PM254-2-13-Z-8.5/3142419.html; Supplier: LCSC; Holes Structure: 2x13P; Pitch: 2.54mm; Row Spacing: 2.54mm; Circular Hole / Square Hole: Square Hole; Mounting Type: Through Hole; Number of Rows: 2; Number of Positions: 26P; Current Rating: 3A; Holes Direction: Top; Insulation Height: 8.5mm; Contact Material: Copper Alloy; Operating Temperature: -40℃~+105℃
USB1 = TYPE-C 16PIN 2MD(073): Connector Type:Type-C Protocol Standard:- Gender:Female Mounting Type:Surface Mount, Right Angle Number of Contacts:16P Number of Ports:1 Current Rating-Power:3A Voltage Rating:5V Connect-Disconnect Life:5,000 times Supplementary Features:- Center Height:; LCSC Part Name: 16P卧贴母座; Supplier Part: C2765186; Manufacturer: SHOU HAN(首韩); Supplier Footprint: SMD; JLCPCB Part Class: Extended Part; Datasheet: https://item.szlcsc.com/datasheet/TYPE-C%252016PIN%25202MD(073)/2901843.html; Supplier: LCSC; Connector Type: Type-C; Gender: Female; Mounting Type: Surface Mount, Right Angle; Number of Contacts: 16P; Number of Ports: 1; Current Rating-Power: 3A; Voltage Rating: 5V; Connect-Disconnect Life: 5,000 times; Detection color: Black; Operating Temperature: -25℃~+85℃
USB2 = USB-226-BRY: Connector Type:Type-A Protocol Standard:USB 2.0 Gender:Female Mounting Type:Vertical, Flag Number of Contacts:4P Number of Ports:1 Current Rating-Power:1.5A Voltage Rating:30V Length:19.4mm Detection color:White Operating Temperature:-20℃~+70℃ Operating T; LCSC Part Name: Type-A 母 侧插; Supplier Part: C720523; Manufacturer: XUNPU(讯普); Supplier Footprint: 插件; JLCPCB Part Class: Extended Part; Datasheet: https://item.szlcsc.com/datasheet/USB-226-BRY/763530.html; Supplier: LCSC; Connector Type: Type-A; Protocol Standard: USB 2.0; Gender: Female; Mounting Type: Vertical, Flag; Number of Contacts: 4P; Number of Ports: 1; Current Rating-Power: 1.5A; Voltage Rating: 30V; Length: 19.4mm; Detection color: White; Operating Temperature: -20℃~+70℃
X1 = X32258MOB4SI: Type:Crystal Oscillator Frequency:8MHz Normal temperature Frequency Tolerance:±10ppm Normal temperature Frequency Tolerance:±10ppm Load Capacitance:12pF Frequency Stability:±20ppm Frequency Stability:±20ppm Equivalent Series Resistance(ESR):150Ω Operating; LCSC Part Name: YSX321SL 8MHZ 4P 3225 12PF ±10PPM -40~85℃ (±20PPM); Supplier Part: C2682775; Manufacturer: YXC(扬兴晶振); Supplier Footprint: SMD3225-4P; JLCPCB Part Class: Extended Part; Datasheet: https://item.szlcsc.com/datasheet/X32258MOB4SI/2777872.html; Supplier: LCSC; Type: Crystal Oscillator; Normal temperature Frequency Tolerance: ±10ppm; Load Capacitance: 12pF; Frequency Stability: ±20ppm; Equivalent Series Resistance(ESR): 150Ω; Operating Temperature: -40℃~+85℃

## Nets
1V1: C1.2 C2.2 C3.2 C19.2 L2.1 MAIN.10(DVDD) MAIN.32(DVDD) MAIN.51(DVDD) MAIN.65(VREG_FB) U5.5(OUT)
1V1V: C39.2 C40.2 C41.2 C44.2 L4.1 U14.5(OUT) VIDEO.10(DVDD) VIDEO.32(DVDD) VIDEO.51(DVDD) VIDEO.65(VREG_FB)
3V3: 3v3.1 C4.2 C5.2 C6.2 C7.2 C8.2 C9.2 C10.2 C11.2 C12.2 C13.2 C14.2 C15.2 C20.2 C22.2 C23.2 C24.2 C25.2 C30.1 C30.2 C54.2 C63.1 C64.1 C68.1 CONNECT.8 L1.2 MAIN.5(IOVDD) MAIN.15(IOVDD) MAIN.24(IOVDD) MAIN.29(IOVDD) MAIN.41(IOVDD) MAIN.50(IOVDD) MAIN.60(IOVDD) MAIN.64(VREG_VIN) MAIN.68(USB_OTP_VDD) MAIN.69(QSPI_IOVDD) MAIN.76(IOVDD) PMODE.2 PMODE2.1(A1) R1.2 R3.1 R6.1 R7.1 R8.1 R14.2 R15.1 R16.1 R23.1 R24.1 R25.2 R27.1 R28.2 R41.1 SW1.8 U4.2(OUT) U4.4(OUT) U5.3(EN) U6.8(VCC) U7.8(Vcc) U8.4(VCC) U8.18(AVCC) U9.8(V3) U10.11(VCC) U18.25
3V3V: 3v3v.1 C32.2 C33.2 C34.2 C35.2 C36.2 C37.2 C38.2 C42.2 C43.2 C45.2 C49.2 C50.2 C51.2 C52.2 C53.2 C70.1 C71.1 CONNECT.10 L3.2 PMODE1.2 R12.2 R17.1 R42.1 SW2.8 U13.2(OUT) U13.4(OUT) U14.3(EN) U15.8(VCC) U16.8(Vcc) VIDEO.5(IOVDD) VIDEO.15(IOVDD) VIDEO.24(IOVDD) VIDEO.29(IOVDD) VIDEO.41(IOVDD) VIDEO.50(IOVDD) VIDEO.60(IOVDD) VIDEO.64(VREG_VIN) VIDEO.68(USB_OTP_VDD) VIDEO.69(QSPI_IOVDD) VIDEO.76(IOVDD)
+5V: 5v.1 BAT.1 F1.1 POWM.2 POWV.2 U5.1(IN) U9.5(VCC) U14.1(IN) U17.1 USB1.2(VBUS) USB1.11(VBUS)
GND: BAT.2 BOOTSELM.3 BOOTSELV.3 C1.1 C2.1 C3.1 C4.1 C5.1 C6.1 C7.1 C8.1 C9.1 C10.1 C11.1 C12.1 C13.1 C14.1 C15.1 C16.1 C17.1 C18.1 C19.1 C20.1 C22.1 C23.1 C24.1 C25.1 C28.2 C29.2 C31.1 C32.1 C33.1 C34.1 C35.1 C36.1 C37.1 C38.1 C39.1 C40.1 C41.1 C42.1 C43.1 C44.1 C45.1 C47.1 C48.1 C49.1 C50.1 C51.1 C52.1 C53.1 C63.2 C64.2 C65.2 C66.2 C67.2 C68.2 C69.2 C70.2 C71.2 CLED1.1(K) CLED2.1(K) CONNECT.9 GND.1 HDMI.2(TMDS Data 2 Shield) HDMI.5(TMDS Data 1 Shield) HDMI.8(TMDS Data 0 Shield) HDMI.11(TMDS Clock Shield) HDMI.20(GND) HDMI.21(GND) HDMI.22(GND) HDMI.23(GND) MAIN.62(VREG_PGND) MAIN.81(GND) PCS.4 PCS.5 PCS1.4 PCS1.5 POWERMAIN.1(K) POWERVIDEO.1(K) R2.1 R4.1 R5.1 R11.1 R22.1 R32.1 R33.1 R43.2 RSTA.3 RSTP.3 RSTP1.3 U1.2(GND) U1.4(GND) U4.1(ADJ/GND) U5.2(GND) U6.4(GND) U7.4(Vss) U8.5(GND) U8.21(GND) U9.3(GND) U10.6(CFG) U10.12(LED1) U10.13(ETH) U10.14(ETH) U11.2(GND) U11.4(GND) U13.1(ADJ/GND) U14.2(GND) U15.4(GND) U16.4(Vss) U18.26 USB1.1(GND) USB1.12(GND) USB1.13(SHELL) USB1.14(SHELL) USB2.4(GND) USB2.5(EH) VIDEO.62(VREG_PGND) VIDEO.81(GND) X1.2(GND) X1.4(GND)
A0: VIDEO.49(GPIO40_ADC0)
A1: VIDEO.52(GPIO41_ADC1)
A2: VIDEO.53(GPIO42_ADC2)
A3: VIDEO.54(GPIO43_ADC3)
A4: VIDEO.55(GPIO44_ADC4)
A5: VIDEO.56(GPIO45_ADC5)
A6: VIDEO.57(GPIO46_ADC6)
A7: VIDEO.58(GPIO47_ADC7)
CLK: SW1.5 SW2.5 U8.12((CLKO/ICP1/PTCXY)PB0)
CS0: PCS.3 PCS1.3 U8.14((OC1B/SS0/PTCXY)PB2)
D+: D11.2 MAIN.67(USB_DP)
D+V: VIDEO.67(USB_DP)
D-: D11.1 MAIN.66(USB_DM)
D-V: VIDEO.66(USB_DM)
GPIO0: MAIN.77(GPIO0)
GPIO0V: VIDEO.77(GPIO0)
GPIO2: MAIN.79(GPIO2) U10.8(RXD)
GPIO2V: D10.2(A) VIDEO.79(GPIO2)
GPIO3: MAIN.80(GPIO3) U10.9(TXD)
GPIO3V: D9.2(A) VIDEO.80(GPIO3)
GPIO4: MAIN.1(GPIO4)
GPIO4V: D3.2(A) VIDEO.1(GPIO4)
GPIO5: MAIN.2(GPIO5)
GPIO5V: D4.2(A) VIDEO.2(GPIO5)
GPIO6: MAIN.3(GPIO6)
GPIO6V: D8.2(A) VIDEO.3(GPIO6)
GPIO7: MAIN.4(GPIO7)
GPIO7V: D7.2(A) VIDEO.4(GPIO7)
GPIO8: MAIN.6(GPIO8)
GPIO8V: D5.2(A) VIDEO.6(GPIO8)
GPIO9: MAIN.7(GPIO9)
GPIO9V: D6.2(A) VIDEO.7(GPIO9)
GPIO10: MAIN.8(GPIO10) MATRIX.16(COL8)
GPIO10V: HDMI.19(Hot Plug Detect) R22.2 VIDEO.8(GPIO10)
GPIO11: MAIN.9(GPIO11) MATRIX.15(COL7)
GPIO11V: HDMI.16(SDA) R15.2 VIDEO.9(GPIO11)
GPIO12: MAIN.11(GPIO12) MATRIX.11(COL6)
GPIO12V: HDMI.15(SCL) R14.1 VIDEO.11(GPIO12)
GPIO13: MAIN.12(GPIO13) MATRIX.6(COL5)
GPIO13V: HDMI.17(DDC/CEC Ground) R23.2 VIDEO.12(GPIO13)
GPIO14: MAIN.13(GPIO14) MATRIX.10(COL4)
GPIO14V: VIDEO.13(GPIO14)
GPIO15: MAIN.14(GPIO15) MATRIX.4(COL3)
GPIO15V: VIDEO.14(GPIO15)
GPIO16: MAIN.16(GPIO16) MATRIX.3(COL2)
GPIO16V: VIDEO.16(GPIO16)
GPIO17: MAIN.17(GPIO17) MATRIX.13(COL1)
GPIO17V: VIDEO.17(GPIO17)
GPIO18: MAIN.18(GPIO18)
GPIO18V: VIDEO.18(GPIO18)
GPIO19: MAIN.19(GPIO19)
GPIO19V: VIDEO.19(GPIO19)
GPIO20: MAIN.20(GPIO20)
GPIO20V: VIDEO.20(GPIO20)
GPIO21: MAIN.21(GPIO21)
GPIO21V: VIDEO.21(GPIO21)
GPIO22: MAIN.22(GPIO22)
GPIO22V: VIDEO.22(GPIO22)
GPIO23: MAIN.23(GPIO23)
GPIO23V: VIDEO.23(GPIO23)
GPIO24: MAIN.25(GPIO24)
GPIO24V: VIDEO.25(GPIO24)
GPIO26: MAIN.27(GPIO26) R34.2
GPIO26V: U18.1 VIDEO.27(GPIO26)
GPIO27: MAIN.28(GPIO27) R35.2
GPIO27V: U18.3 VIDEO.28(GPIO27)
GPIO28: MAIN.36(GPIO28) R36.2
GPIO28V: U18.5 VIDEO.36(GPIO28)
GPIO29: MAIN.37(GPIO29) R37.2
GPIO29V: U18.7 VIDEO.37(GPIO29)
GPIO30: MAIN.38(GPIO30) R38.2
GPIO30V: U18.9 VIDEO.38(GPIO30)
GPIO31: MAIN.39(GPIO31) R39.2
GPIO31V: U18.2 VIDEO.39(GPIO31)
GPIO32: MAIN.40(GPIO32) MATRIX.14(ROW2)
GPIO32V: U18.4 VIDEO.40(GPIO32)
GPIO33: MAIN.42(GPIO33) R40.2
GPIO33V: U18.6 VIDEO.42(GPIO33)
GPIO34: CONNECT.11 MAIN.43(GPIO34)
GPIO34V: U18.8 VIDEO.43(GPIO34)
GPIO35: MAIN.44(GPIO35) U18.16
GPIO35V: U18.10 VIDEO.44(GPIO35)
GPIO36: MAIN.45(GPIO36) U18.18
GPIO36V: U18.12 VIDEO.45(GPIO36)
GPIO37: MAIN.46(GPIO37) U18.20
GPIO37V: U18.14 VIDEO.46(GPIO37)
GPIO40: MAIN.49(GPIO40_ADC0)
GPIO41: MAIN.52(GPIO41_ADC1)
GPIO42: MAIN.53(GPIO42_ADC2)
GPIO43: MAIN.54(GPIO43_ADC3)
GPIO44: MAIN.55(GPIO44_ADC4)
GPIO45: MAIN.56(GPIO45_ADC5)
GPIO46: MAIN.57(GPIO46_ADC6)
GPIO47: MAIN.58(GPIO47_ADC7)
MISO: SW1.6 SW2.6 U8.16((MISO0/RXD1/PTCXY)PB4)
MOSI: SW1.7 SW2.7 U8.15((MOSI0/TXD1/OC2A/PTCXY)PB3)
PC1: CONNECT.1 U8.24((SCK1/ADC1/PTCY)PC1)
PC2: CONNECT.2 U8.25((ADC2/PTCY)PC2)
PC3: CONNECT.3 U8.26((ADC3/PTCY)PC3)
PC4: CONNECT.4 U8.27((SDA0/ADC4/PTCY)PC4)
PC5: CONNECT.5 U8.28((SCL0/ADC5/PTCY)PC5)
PD2: U8.32((OC3B/OC4B/INT0/PTCXY)PD2) U18.11
PD3: U8.1((OC2B/INT1/PTCXY)PD3) U18.13
PD4: U8.2((XCK0/T0/PTCXY)PD4) U18.15
PD5: U8.9((OC0B/T1/PTCXY)PD5) U18.17
PD6: U8.10((OC0A/AIN0/PTCXY)PD6) U18.19
PM: SW1.4 SW2.4
RUN: MAIN.35(RUN) R3.2 RSTP.1
RUNV: R13.2 RSTP1.1 VIDEO.35(RUN)
RX1: MAIN.48(GPIO39) MRX.1 R31.1
SCL1: CONNECT.6 U8.6(PE1(PTCXY/SCL1/T4))
SCLK: CONNECT.16 MAIN.71(QSPI_SCLK) SW1.1 U6.6(CLK) U7.6(SCK)
SCLKV: SW2.1 U15.6(CLK) U16.6(SCK) VIDEO.71(QSPI_SCLK)
SD0: CONNECT.15 MAIN.72(QSPI_SD0) SW1.3 SW2.3 U6.5(DI/IO0) U7.5(SI/SIO0) U16.5(SI/SIO0)
SD0V: U15.5(DI/IO0) VIDEO.72(QSPI_SD0)
SD1: CONNECT.14 MAIN.74(QSPI_SD1) SW1.2 U6.2(DO/IO1) U7.2(SO/SIO1)
SD1V: SW2.2 U15.2(DO/IO1) U16.2(SO/SIO1) VIDEO.74(QSPI_SD1)
SD2: CONNECT.13 MAIN.73(QSPI_SD2) U6.3(IO2)
SD2V: U15.3(IO2) VIDEO.73(QSPI_SD2)
SD3: CONNECT.12 MAIN.70(QSPI_SD3) U6.7(IO3)
SD3V: U15.7(IO3) VIDEO.70(QSPI_SD3)
SDA1: CONNECT.7 U8.3(PE0(PTCXY/SDA1/ICP4/ACO))
SS: BOOTSELM.1 MAIN.75(QSPI_SS) R41.2 U6.1(/CS)
SSV: BOOTSELV.1 R42.2 U15.1(/CS) VIDEO.75(QSPI_SS)
SWCLK: R25.1 R26.1 U18.21
SWCLKV: R28.1 R29.1 U18.23
SWDIO: MAIN.34(SWDIO) R24.2 U18.22
SWDIOV: R27.2 U18.24 VIDEO.34(SWDIO)
TX1: MTX.1 R30.1 VIDEO.48(GPIO39)
XIN: C17.2 MAIN.30(XIN) U1.1
XINV: C47.2 U11.1 VIDEO.30(XIN)
XOUT: C18.2 MAIN.31(XOUT) U1.3
XOUTV: C48.2 U11.3 VIDEO.31(XOUT)
$1N4694: C16.2 MAIN.61(VREG_AVDD) R1.1
$1N4705: L1.1 MAIN.59(ADC_AVDD)
$1N4707: L2.2 MAIN.63(VREG_LX)
$1N7181: H1.1 U8.31((TXD0/OC4A/PTCXY)PD1) U9.7(RXD)
$1N7187: H1.2 U8.30((RXD0/OC3A/PTCXY)PD0) U9.6(TXD)
$1N7439: PCS.2 U7.1(CS#)
$1N7680: MAIN.78(GPIO1) PMODE.1(A1) R2.2
$1N8416: C28.1 U8.7((XTAL1/TOSC1)PB6) X1.1
$1N8458: C29.1 U8.8((XTAL2/TOSC2)PB7) X1.3
$1N8746: RSTA.2 U8.29((RESET#)PC6)
$1N13312: R4.2 USB1.10(CC2)
$1N13318: R5.2 USB1.4(CC1)
$1N13992: LINK.2(A) R8.2
$1N13996: LINK.1(K) U10.3(LINK)
$1N14043: LED2.2(A) R7.2
$1N14047: LED2.1(K) U10.7(LED2)
$1N14094: LED1.2(A) R6.2
$1N14099: LED1.1(K) U10.10(GND)
$1N17824: PMODE1.1(A1) R11.2 VIDEO.78(GPIO1)
$1N31329: PCS1.2 U16.1(CS#)
$1N31417: C31.2 R12.1 VIDEO.61(VREG_AVDD)
$1N31440: L3.1 VIDEO.59(ADC_AVDD)
$1N31469: L4.2 VIDEO.63(VREG_LX)
$1N31476: C54.1 R13.1
$1N32412: POWERMAIN.2(A) R16.2
$1N32573: POWERVIDEO.2(A) R17.2
$1N32800: CLED1.2(A) R18.1
$1N32808: MAIN.26(GPIO25) R18.2
$1N32913: CLED2.2(A) R19.1
$1N32921: R19.2 VIDEO.26(GPIO25)
$1N33051: C66.1 POWM.1(A1) U4.3(IN)
$1N33109: C69.1 POWV.1(A1) U13.3(IN)
$1N37624: D2.1(A) USB1.5(DN2) USB1.7(DN1)
$1N37671: D1.1(A) USB1.6(DP1) USB1.8(DP2)
$1N37752: D1.2(K) R21.2
$1N37756: R21.1 U9.1(UD+)
$1N37796: D2.2(K) R20.2
$1N37800: R20.1 U9.2(UD-)
$1N37832: C55.2 HDMI.4(TMDS Data 1+)
$1N37864: C56.2 HDMI.6(TMDS Data 1-)
$1N37928: C57.2 HDMI.10(TMDS Clock+)
$1N37930: C58.2 HDMI.12(TMDS Clock-)
$1N37996: C60.1 HDMI.9(TMDS Data 0-)
$1N38002: C59.1 HDMI.7(TMDS Data 0+)
$1N38064: C61.1 HDMI.1(TMDS Data 2+)
$1N38066: C62.1 HDMI.3(TMDS Data 2-)
$1N38363: C55.1 D3.1(C)
$1N38408: C56.1 D4.1(C)
$1N38543: C58.1 D6.1(C)
$1N38549: C57.1 D5.1(C)
$1N38651: C62.2 D7.1(C)
$1N38657: C61.2 D8.1(C)
$1N38747: C59.2 D10.1(C)
$1N38753: C60.2 D9.1(C)
$1N38892: MAIN.33(SWCLK) R26.2
$1N39060: R29.2 VIDEO.33(SWCLK)
$1N39477: R31.2 VIDEO.47(GPIO38)
$1N39520: MAIN.47(GPIO38) R30.2
$1N39637: D11.4 R32.2 USB2.2(D-)
$1N39643: D11.3 R33.2 USB2.3(D+)
$1N39903: U17.2 USB2.1(VCC)
$1N39994: C65.1 F1.2 HDMI.18(+5V Power)
$1N40638: MATRIX.5(ROW8) R34.1
$1N40684: MATRIX.2(ROW7) R35.1
$1N40727: MATRIX.7(ROW6) R36.1
$1N40770: MATRIX.1(ROW5) R37.1
$1N40813: MATRIX.12(ROW4) R38.1
$1N40893: MATRIX.9(ROW1) R40.1
$1N40936: MATRIX.8(ROW3) R39.1
$1N63110: PMODE2.2 R43.1 U8.23((MISO1/ADC0/PTCY)PC0)

Not connected (* = marked no-connect by the designer): BOOTSELM 2* 4*; BOOTSELV 2* 4*; C67 1; H1 3 4; HDMI 13(CEC)* 14(Reserved (N.C.))*; PCS 1; PCS1 1; RSTA 1 4; RSTP 2* 4*; RSTP1 2 4; U5 4(NC)*; U7 3(NC)* 7(VBAT)*; U8 11((AIN1/PTCXY)PD7) 13((OC1A/PTCXY)PB1) 17((XCK0/SCK0/PTCXY)PB5) 19(PE2(PTCY/ADC6/ICP3/SS1)) 20(AREF) 22(PE3(PTCY/ADC7/T3/MOSI1)); U9 4(RTS#)*; U10 1(NC)* 2(NC)* 4(RST)* 5(485_EN)*; U14 4(NC)*; U16 3(NC)* 7(VBAT)*; USB1 3(SBU2)* 9(SBU1)*

## Notes on the sheet
- INTERFACE
- CORE VIDEO
- CORE MAIN
- VDD supply caps
- VDD supply caps
- POWER R
- POWER M
- ADC ref
- ADC ref
- PROGRAMMING / USB C
- ABM8-272-T3
  2x 10-15pF
- 3225-12M-SR
  2x 8-10pF
- ABM8-272-T3
  2x 10-15pF
- 3225-12M-SR
  2x 8-10pF
- CLOCK
- CLOCK
- CS
- GCM1555C1H8R0DA16D 8pf
  GRM1555C1H9R0DA01D 9pf
  MT15N100J500CT 10pf
- GCM1555C1H8R0DA16D 8pf
  GRM1555C1H9R0DA01D 9pf
  MT15N100J500CT 10pf
- VREG
- VREG
- orig: W25Q128JVSIQTR
- FLASH
- orig: W25Q128JVSIQTR
- FLASH
- VIDEO TX
- MAIN TX
- SRAM
- SRAM
